# EAGLE design mayfly_platform_revC (EAGLE 8.5.0)
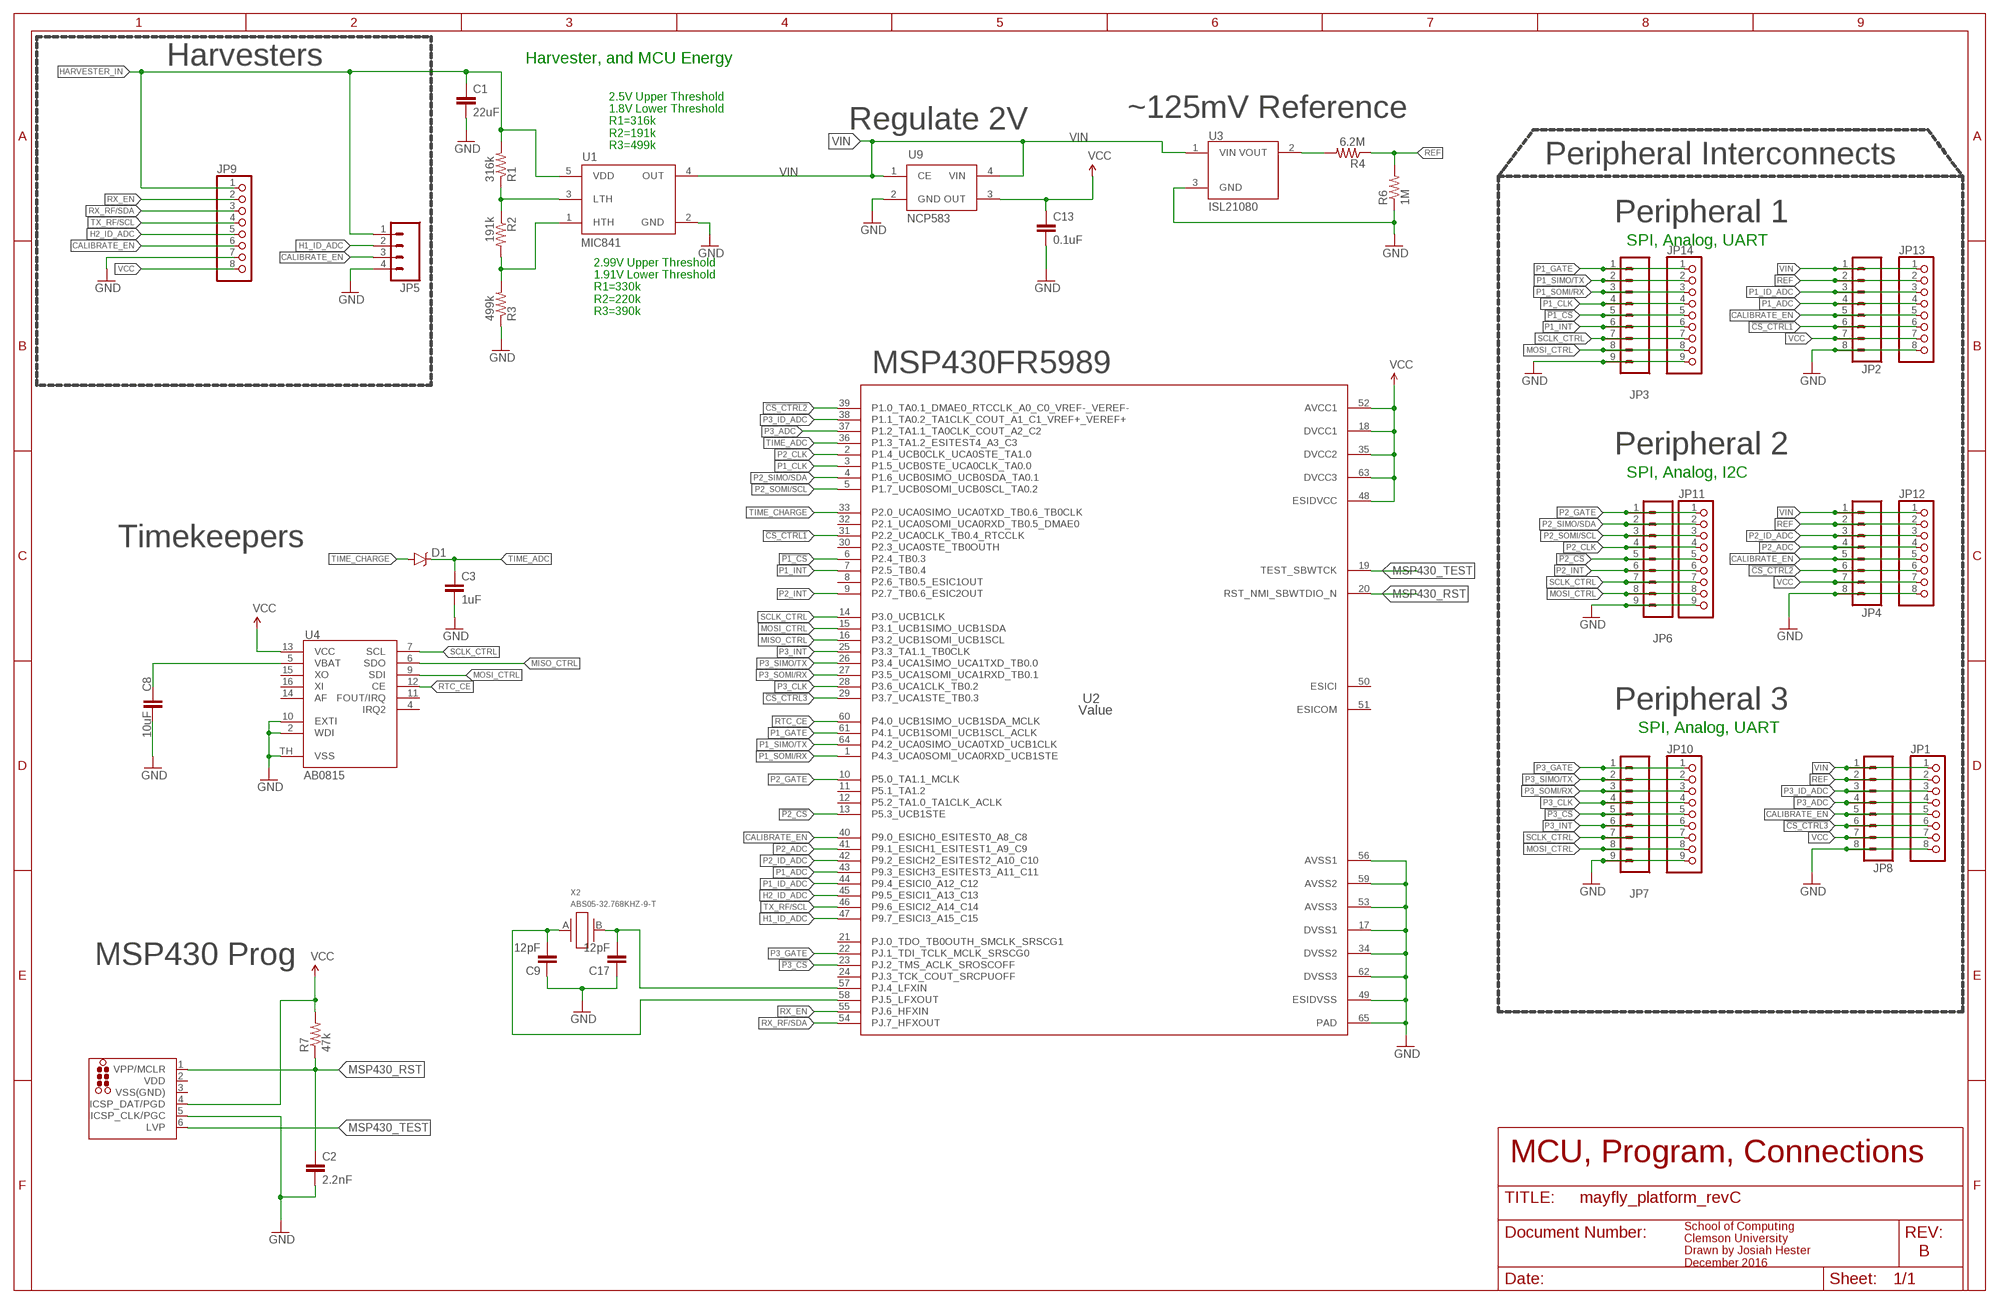
[diagram p0: schematic, sheet 1]

## Parts
C1  22uF  CAP1210  [1210]
C2  2.2nF  C-EU0603  [0603]
C3  1uF  C-EU0603  [0603]
C8  10uF  CAP0805  [0805]
C9  12pF  C-EU0603  [0603]
C13  0.1uF  C-EU0603  [0603]
C17  12pF  C-EU0603  [0603]
D1  RB751  DIODE-SCHOTTKY-RB751  [SOD-523]
J1  TC2030-MCP-NL  [TC2030-MCP-NL]
JP1  PINHD-1X8  [1X08]
JP2  M081.27MM  [1X08-1.27MM]
JP3  M091.27MM  [1X09-1.27MM]
JP4  M081.27MM  [1X08-1.27MM]
JP5  M041.27MM  [1X04-1.27MM]
JP6  M091.27MM  [1X09-1.27MM]
JP7  M091.27MM  [1X09-1.27MM]
JP8  M081.27MM  [1X08-1.27MM]
JP9  PINHD-1X8  [1X08]
JP10  PINHD-1X9  [1X09]
JP11  PINHD-1X9  [1X09]
JP12  PINHD-1X8  [1X08]
JP13  PINHD-1X8  [1X08]
JP14  PINHD-1X9  [1X09]
R1  316k  R-EU0603  [0603]
R2  191k  R-EU0603  [0603]
R3  499k  R-EU0603  [0603]
R4  6.2M  R-EU0603  [0603]
R6  1M  R-EU0603  [0603]
R7  47k  R-EU0603  [0603]
U1  MIC841  [SC70-5]
U2  Value  MSP430FR5989IRGCR  [RGC0064B]
U3  ISL21080  [SOT-23]
U4  AB0815  [QFN16]
U9  NCP583  [SC82-AB_1PRIMARY]
X2  ABS05-32.768KHZ-9-T  [ABS05]

## Nets
!CS_CTRL1: JP2.6 JP13.6 U2.31(P2.2_UCA0CLK_TB0.4_RTCCLK)
!CS_CTRL2: JP4.6 JP12.6 U2.39(P1.0_TA0.1_DMAE0_RTCCLK_A0_C0_VREF-_VEREF-)
!CS_CTRL3: JP1.6 JP8.6 U2.29(P3.7_UCA1STE_TB0.3)
!P1_CS: JP3.5 JP14.5 U2.6(P2.4_TB0.3)
!P2_CS: JP6.5 JP11.5 U2.13(P5.3_UCB1STE)
!P3_CS: JP7.5 JP10.5 U2.23(PJ.2_TMS_ACLK_SROSCOFF)
CALIBRATE_EN: JP1.5 JP2.5 JP4.5 JP5.3 JP8.5 JP9.6 JP12.5 JP13.5 U2.40(P9.0_ESICH0_ESITEST0_A8_C8)
GND: C1.2 C2.2 C3.2 C8.2 C9.1 C13.2 C17.1 J1.5(ICSP_CLK/PGC) JP1.8 JP2.8 JP3.9 JP4.8 JP5.4 JP6.9 JP7.9 JP8.8 JP9.7 JP10.9 JP11.9 JP12.8 JP13.8 JP14.9 R3.1 R6.1 U1.2(GND) U2.17(DVSS1) U2.34(DVSS2) U2.49(ESIDVSS) U2.53(AVSS3) U2.56(AVSS1) U2.59(AVSS2) U2.62(DVSS3) U2.65(PAD) U3.3(GND) U4.2(WDI) U4.10(EXTI) U4.TH(VSS) U9.2(GND)
H1_ID_ADC: JP5.2 U2.47(P9.7_ESICI3_A15_C15)
H2_ID_ADC: JP9.5 U2.45(P9.5_ESICI1_A13_C13)
HARVESTER_IN: C1.1 JP5.1 JP9.1 R1.2 U1.5(VDD)
MISO_CTRL: U2.16(P3.2_UCB1SOMI_UCB1SCL) U4.6(SDO)
MOSI_CTRL: JP3.8 JP6.8 JP7.8 JP10.8 JP11.8 JP14.8 U2.15(P3.1_UCB1SIMO_UCB1SDA) U4.9(SDI)
MSP430_RST: C2.1 J1.1(VPP/MCLR) R7.1 U2.20(RST_NMI_SBWTDIO_N)
MSP430_TEST: J1.6(LVP) U2.19(TEST_SBWTCK)
N$1: R1.1 R2.1 U1.3(LTH)
N$2: R4.2 U3.2(VOUT)
N$3: R2.2 R3.2 U1.1(HTH)
N$5: C17.2 U2.57(PJ.4_LFXIN) X2.B
N$6: C9.2 U2.58(PJ.5_LFXOUT) X2.A
N$8: C8.1 U4.5(VBAT)
P1_ADC: JP2.4 JP13.4 U2.43(P9.3_ESICH3_ESITEST3_A11_C11)
P1_CLK: JP3.4 JP14.4 U2.3(P1.5_UCB0STE_UCA0CLK_TA0.0)
P1_GATE: JP3.1 JP14.1 U2.61(P4.1_UCB1SOMI_UCB1SCL_ACLK)
P1_ID_ADC: JP2.3 JP13.3 U2.44(P9.4_ESICI0_A12_C12)
P1_INT: JP3.6 JP14.6 U2.7(P2.5_TB0.4)
P1_SIMO/TX: JP3.2 JP14.2 U2.64(P4.2_UCA0SIMO_UCA0TXD_UCB1CLK)
P1_SOMI/RX: JP3.3 JP14.3 U2.1(P4.3_UCA0SOMI_UCA0RXD_UCB1STE)
P2_ADC: JP4.4 JP12.4 U2.41(P9.1_ESICH1_ESITEST1_A9_C9)
P2_CLK: JP6.4 JP11.4 U2.2(P1.4_UCB0CLK_UCA0STE_TA1.0)
P2_GATE: JP6.1 JP11.1 U2.10(P5.0_TA1.1_MCLK)
P2_ID_ADC: JP4.3 JP12.3 U2.42(P9.2_ESICH2_ESITEST2_A10_C10)
P2_INT: JP6.6 JP11.6 U2.9(P2.7_TB0.6_ESIC2OUT)
P2_SIMO/SDA: JP6.2 JP11.2 U2.4(P1.6_UCB0SIMO_UCB0SDA_TA0.1)
P2_SOMI/SCL: JP6.3 JP11.3 U2.5(P1.7_UCB0SOMI_UCB0SCL_TA0.2)
P3_ADC: JP1.4 JP8.4 U2.37(P1.2_TA1.1_TA0CLK_COUT_A2_C2)
P3_CLK: JP7.4 JP10.4 U2.28(P3.6_UCA1CLK_TB0.2)
P3_GATE: JP7.1 JP10.1 U2.22(PJ.1_TDI_TCLK_MCLK_SRSCG0)
P3_ID_ADC: JP1.3 JP8.3 U2.38(P1.1_TA0.2_TA1CLK_COUT_A1_C1_VREF+_VEREF+)
P3_INT: JP7.6 JP10.6 U2.25(P3.3_TA1.1_TB0CLK)
P3_SIMO/TX: JP7.2 JP10.2 U2.26(P3.4_UCA1SIMO_UCA1TXD_TB0.0)
P3_SOMI/RX: JP7.3 JP10.3 U2.27(P3.5_UCA1SOMI_UCA1RXD_TB0.1)
REF: JP1.2 JP2.2 JP4.2 JP8.2 JP12.2 JP13.2 R4.1 R6.2
RTC_CE: U2.60(P4.0_UCB1SIMO_UCB1SDA_MCLK) U4.12(CE)
RX_EN: JP9.2 U2.55(PJ.6_HFXIN)
RX_RF/SDA: JP9.3 U2.54(PJ.7_HFXOUT)
SCLK_CTRL: JP3.7 JP6.7 JP7.7 JP10.7 JP11.7 JP14.7 U2.14(P3.0_UCB1CLK) U4.7(SCL)
TIME_ADC: C3.1 D1.C U2.36(P1.3_TA1.2_ESITEST4_A3_C3)
TIME_CHARGE: D1.A U2.33(P2.0_UCA0SIMO_UCA0TXD_TB0.6_TB0CLK)
TX_RF/SCL: JP9.4 U2.46(P9.6_ESICI2_A14_C14)
VCC: C13.1 J1.4(ICSP_DAT/PGD) JP1.7 JP2.7 JP4.7 JP8.7 JP9.8 JP12.7 JP13.7 R7.2 U2.18(DVCC1) U2.35(DVCC2) U2.48(ESIDVCC) U2.52(AVCC1) U2.63(DVCC3) U4.13(VCC) U9.3(OUT)
VIN: JP1.1 JP2.1 JP4.1 JP8.1 JP12.1 JP13.1 U1.4(OUT) U3.1(VIN) U9.1(CE) U9.4(VIN)
Unconnected: U2.8(P2.6_TB0.5_ESIC1OUT) U2.11(P5.1_TA1.2) U2.12(P5.2_TA1.0_TA1CLK_ACLK) U2.21(PJ.0_TDO_TB0OUTH_SMCLK_SRSCG1) U2.24(PJ.3_TCK_COUT_SRCPUOFF) U2.30(P2.3_UCA0STE_TB0OUTH) U2.32(P2.1_UCA0SOMI_UCA0RXD_TB0.5_DMAE0) U2.50(ESICI) U2.51(ESICOM) U4.4(IRQ2) U4.11(FOUT/IRQ) U4.14(AF) U4.15(XO) U4.16(XI)

## Notes on the sheet
- Harvesters | Harvester, and MCU Energy
- ~125mV Reference
- Regulate 2V
- 2.5V Upper Threshold
  1.8V Lower Threshold
  R1=316k
  R2=191k
  R3=499k
- Peripheral Interconnects
- Peripheral 1
- SPI, Analog, UART
- 2.99V Upper Threshold
  1.91V Lower Threshold
  R1=330k
  R2=220k
  R3=390k
- MSP430FR5989
- Peripheral 2
- SPI, Analog, I2C
- Timekeepers
- Peripheral 3
- SPI, Analog, UART
- MSP430 Prog
- MCU, Program, Connections
- B
- School of Computing
  Clemson University
  Drawn by Josiah Hester
  December 2016

## Power pins joined to a net without a drawn wire
VDD: J1.2(VDD)
VSS(GND): J1.3(VSS(GND))

## Library data of the parts
C1 = SparkFun-Capacitors:CAP: Capacitor Standard 0603 ceramic capacitor, and 0.1" leaded capacitor.; MANUFACTURERPARTNUMBER: CL32A226KAJNNNE; MPN: CL32A226KAJNNNE
C2 = tiny_passives:C-EU; MPN: 06035C222KAT2A
C3 = tiny_passives:C-EU; MANUFACTURERPARTNUMBER: 0603YD105KAT2A; MPN: 0603YD105KAT2A
C8 = SparkFun-Capacitors:CAP: Capacitor Standard 0603 ceramic capacitor, and 0.1" leaded capacitor.; MPN: 0805YD106KAT2A
C9 C17 = tiny_passives:C-EU; MPN: CL10C120JB8NNNC
C13 = tiny_passives:C-EU; MANUFACTURERPARTNUMBER: 0603YC104KAT2A; MPN: 0603YC104KAT2A
D1 = SparkFun-DiscreteSemi:DIODE-SCHOTTKY: Schottky diodes in SFE's production catalog BAT20J 1A 23V 0.62Vf RB751 120mA 40V 0.37Vf PMEG4005EJ 0.5A 40V 0.42Vf MBRA140 1A 40V 0.5Vf B340A 3A 40V SMA; DIGIKEY: BAS40-02V-V-G-08GICT-ND; MPN: BAS40-02V-V-G-08; PROD_ID: DIO-11018
J1 = tag-connect_msp430:TC2030: TAG-CONNECT ICSP Connector Manufacturer: Tag-Connect <http://www.tag-connect.com> Cable for easy In-Circuit Serial Programming. Designed for Microchip ICD2, suitable for many others. Two variants - one "with legs" (for hands-free fit on PCB) and another "without legs" for quick programming. PAD Description 1 MCLR/Vpp 2 Vdd 3 GND 4 PGD (ISPDAT) 5 PGC (ISPCLK) 6 nc (used for LVP) ©2009 ROFA.cz - modified and updated by Robert Darlington ‹rdarlington@gmail.com›
JP1 JP9 JP12 JP13 = pinhead:PINHD-1X8: PIN HEADER
JP2 JP4 JP8 = SparkFun-Connectors:M08: Header 8 Standard 8-pin 0.1" header. Use with straight break away headers (SKU : PRT-00116), right angle break away headers (PRT-00553), swiss pins (PRT-00743), machine pins (PRT-00117), and female headers (PRT-00115).; DIGIKEY: ED90570-ND; MPN: 851-43-008-10-001000
JP3 JP6 JP7 = SparkFun-Connectors:M09: Header 9 Standard 9-pin 0.1" header. Use with straight break away headers (SKU : PRT-00116), right angle break away headers (PRT-00553), swiss pins (PRT-00743), machine pins (PRT-00117), and female headers (PRT-00115).; DIGIKEY: 1212-1354-ND; MPN: 851-87-009-10-001101
JP5 = SparkFun-Connectors:M04: Header 4 Standard 4-pin 0.1" header. Use with straight break away headers (SKU : PRT-00116), right angle break away headers (PRT-00553), swiss pins (PRT-00743), machine pins (PRT-00117), and female headers (PRT-00115). Molex polarized connector foot print use with SKU : PRT-08231 with associated crimp pins and housings. 1MM SMD Version SKU: PRT-10208; DIGIKEY: ED90528-ND; MANUFACTURERPARTNUMBER: 851-43-004-10-001000; MPN: 851-43-004-10-001000
JP10 JP11 JP14 = pinhead:PINHD-1X9: PIN HEADER
R1 = tiny_passives:R-EU; DIGIKEY: 311-316KHRCT-ND; MANUFACTURERPARTNUMBER: RC0603FR-07316KL; MPN: RC0603FR-07316KL
R2 = tiny_passives:R-EU; DIGIKEY: 311-191KHRCT-ND; MANUFACTURERPARTNUMBER: RC0603FR-07191KL; MPN: RC0603FR-07191KL
R3 = tiny_passives:R-EU; DIGIKEY: 311-499KHRCT-ND; MANUFACTURERPARTNUMBER: RC0603FR-07499KL; MPN: RC0603FR-07499KL
R4 = tiny_passives:R-EU; DIGIKEY: 541-6.20MHCT-ND; MPN: CRCW06036M20FKEA
R6 = tiny_passives:R-EU; DIGIKEY: 311-1.00MHRCT-ND; MPN: RC0603FR-071ML
R7 = tiny_passives:R-EU; MPN: CRCW060347K0JNEA
U1 = fedpower:MIC841: MIC841:Comparator with reference and adj. hysteresis; DIGIKEY: 576-2923-1-ND; MPN: MIC841HYC5-TR
U2 = msp430fr5989:MSP430FR5989IRGCR; ALTERNATEPARTNUMBER: MSP430FR5989IRGCT; COMPTYPE: IC; DIGIKEY: 296-42031-1-ND; MANUFACTURER: Texas Instruments; MOUNTTYPE: SMT; MPN: MSP430FR59891IRGCT; PACKAGEREFERENCE: RGC0064B; PARTNUMBER: MSP430FR5989IRGCR; PIN_COUNT: 65; REFDES: RefDes; ROHS: Y; TYPE: TYPE
U3 = isl21080:ISL21080: Intersil: ISL21080, 300nA NanoPower Voltage References The ISL21080 analog voltage references feature low supply voltage operation at ultra-low 310nA typ, 1.5µA max operating current. Additionally, the ISL21080 family features guaranteed initial accuracy as low as ±0.2% and 50ppm/°C temperature coefficient. These references are ideal for general purpose portable applications to extend battery life at lower cost. The ISL21080 is provided in the industry standard 3 Ld SOT-23 pinout. The ISL21080 output voltages can be used as precision voltage sources for voltage monitors, control loops, standby voltages for low power states for DSP, FPGA, Datapath Controllers, microcontrollers and other core voltages: 0.9V, 1.024V, 1.25V, 1.5V, 2.048V, 2.5V, 3.0V, 3.3V, 4.096V and 5.0V. Special Note: Post-assembly x-ray inspection may lead to permanent changes in device output voltage and should be minimized or avoided. For further information, please see “Applications Information” on page 14 and AN1533, “X-Ray Effects on Intersil FGA References”.; DIGIKEY: ISL21080DIH309Z-TKCT-ND; MPN: ISL21080DIH309Z-TK
U4 = AB08XX:AB0815: AB08X5 Real-Time Clock Family: SPI The ABRACON AB08X5 Real-Time Clock family provides a groundbreaking combination of ultra-low power coupled with a highly sophisticated feature set. With power requirements significantly lower than any other industry RTC (as low as 14 nA), these are the first semiconductors based on innovative SPOTTM (Subthreshold Power Optimized Technology) CMOS platform. The AB08X5 includes on-chip oscillators to provide minimum power consumption, full RTC functions including battery backup and programmable counters and alarms for timer and watchdog functions, and either an I2C or SPI serial interface for communication with a host controller.; DIGIKEY: 535-11930-1-ND; MPN: AB0815-T3
U9 = ncp583:NCP583: NCP583 - Ultra-Low Iq 150 mA CMOS LDO Regulator with Enable The NCP583 series of low dropout regulators are designed for portable battery powered applications which require precise output voltage accuracy and low quiescent current. These devices feature an enable function which lowers current consumption significantly and are offered in two small packages; SC−82AB and the SOT−563. A 1.0 mF ceramic capacitor is the recommended value to be used with these devices on the output pin.; DIGIKEY: NCP583SQ18T1GOSCT-ND; MPN: NCP583SQ18T1G
X2 = abs05:ABS05-32.768KHZ: 32.768kHz Crystal; DIGIKEY: 535-11897-1-ND; MPN: ABS05-32.768KHZ-9-T

## Board
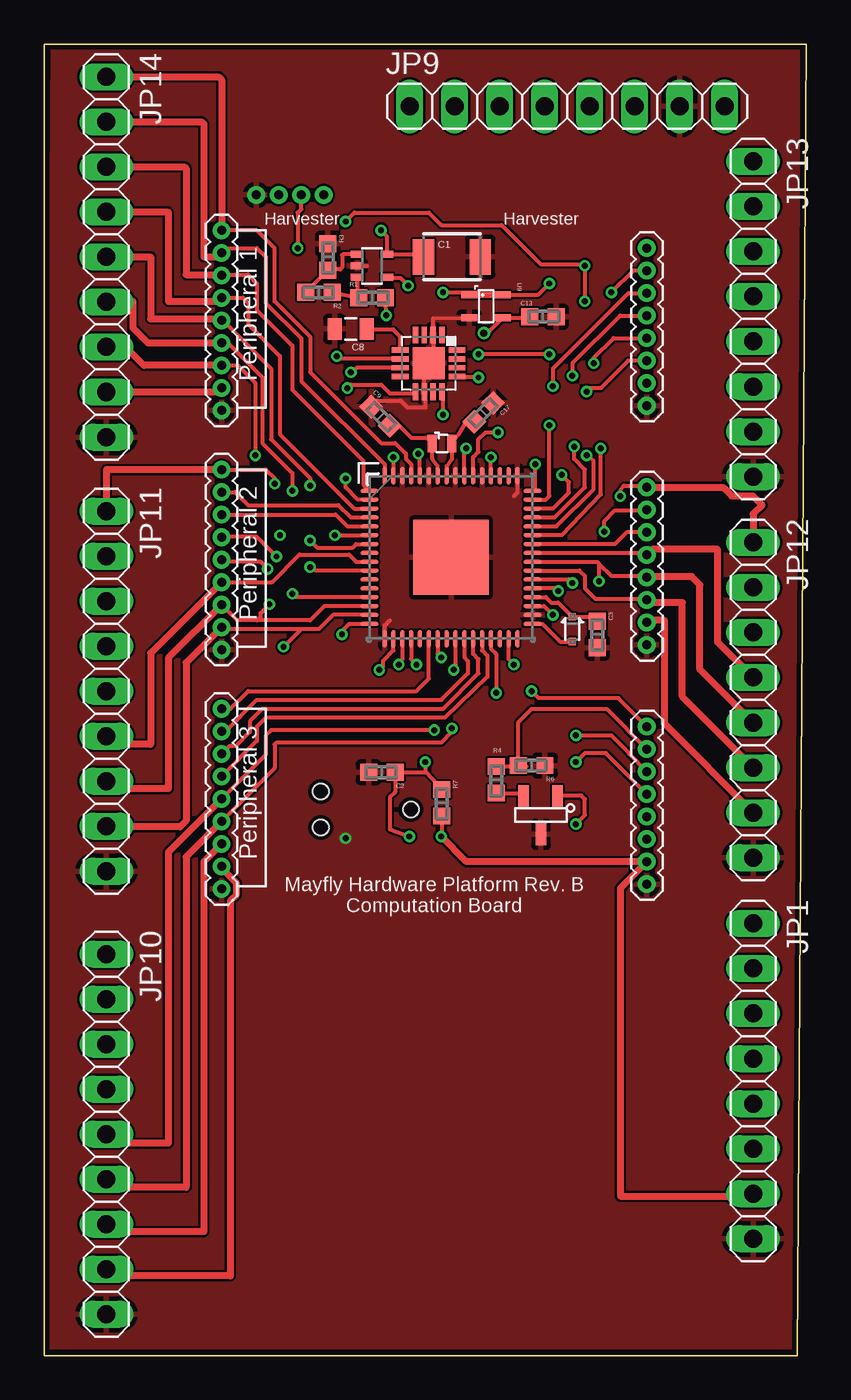
[diagram p1: board, top side]
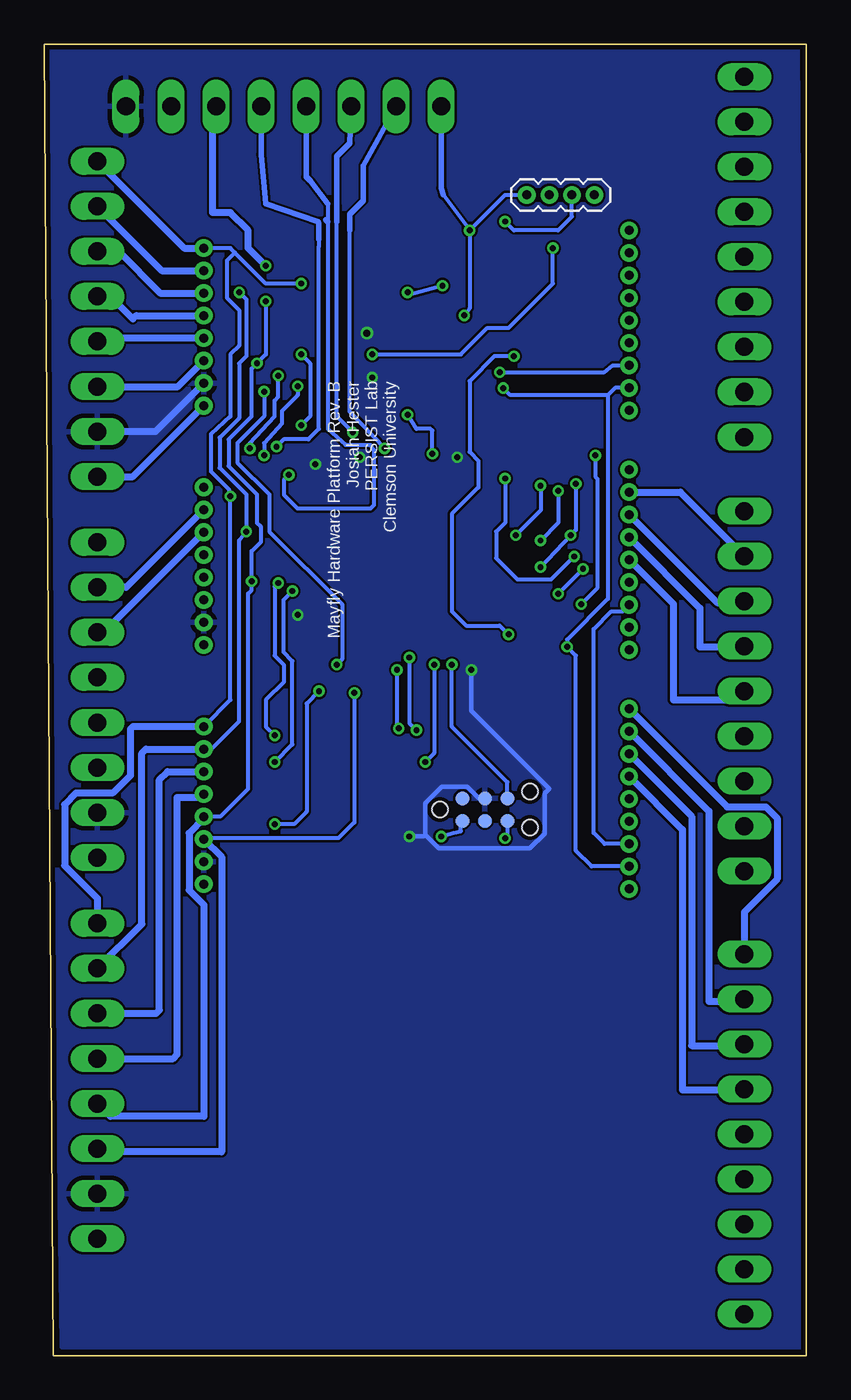
[diagram p2: board, bottom side, seen from below]

Size 43 x 74 mm. Coordinates in mm from the lower left corner, seen from the top.
Outline: 43,74 0,74 0,0 42.5,0 43,74
Copper layers (1*16): Top 0.035mm / dielectric 1.5mm / Bottom 0.035mm
Design rules "MF_Standard_2_Layer": minimum track width 5mil, minimum drill 12mil, track to track 5mil, track to pad 5mil, pad to pad 5mil, via to via 5mil, smd to smd 0mil, copper to edge 10mil, drill to drill 10mil, minimum pad ring 6mil, minimum via ring 6mil, stop-mask expansion 2mil, vias tented up to drill 25mil, thermal gap 10mil

### Footprints (pad centres in the part's own frame; a part is rotated, then mirrored left to right if it is on the bottom)
1210 = smd 1.2 x 2: 1 -1.6,0; 2 1.6,0
0603 = smd 0.95 x 0.95: 1 -0.75,0; 2 0.75,0
0805 = smd 0.8 x 1.2: 1 -0.9,0; 2 0.9,0
SOD-523 = smd 0.4 x 0.4: A -0.7,0; C 0.7,0
TC2030-MCP-NL = smd 0.787 x 0.787: 1 1.27,-0.635; 2 1.27,0.635; 3 2.54,-0.635; 4 2.54,0.635; 5 3.81,-0.635; 6 3.81,0.635 | hole 0.889: 0,0; 5.08,-1.016; 5.08,1.016
1X08 = drill 1.016 long: 1 -8.89,0; 2 -6.35,0; 3 -3.81,0; 4 -1.27,0; 5 1.27,0; 6 3.81,0; 7 6.35,0; 8 8.89,0
1X08-1.27MM = drill 0.508 pad 1: 1 0,0; 2 1.27,0; 3 2.54,0; 4 3.81,0; 5 5.08,0; 6 6.35,0; 7 7.62,0; 8 8.89,0
1X09-1.27MM = drill 0.508 pad 1: 1 0,0; 2 1.27,0; 3 2.54,0; 4 3.81,0; 5 5.08,0; 6 6.35,0; 7 7.62,0; 8 8.89,0; 9 10.16,0
1X04-1.27MM = drill 0.508 pad 1: 1 0,0; 2 1.27,0; 3 2.54,0; 4 3.81,0
1X09 = drill 1.016 long: 1 -10.16,0; 2 -7.62,0; 3 -5.08,0; 4 -2.54,0; 5 0,0; 6 2.54,0; 7 5.08,0; 8 7.62,0; 9 10.16,0
SC70-5 = smd 0.4 x 0.7: 1 -0.65,-0.85; 2 0,-0.85; 3 0.65,-0.85; 4 0.65,0.85; 5 -0.65,0.85
RGC0064B = smd 1 x 0.23: 1 -4.6,3.75; 2 -4.6,3.25; 3 -4.6,2.75; 4 -4.6,2.25; 5 -4.6,1.75; 6 -4.6,1.25; 7 -4.6,0.75; 8 -4.6,0.25; 9 -4.6,-0.25; 10 -4.6,-0.75; 11 -4.6,-1.25; 12 -4.6,-1.75; 13 -4.6,-2.25; 14 -4.6,-2.75; 15 -4.6,-3.25; 16 -4.6,-3.75; 33 4.6,-3.75; 34 4.6,-3.25; 35 4.6,-2.75; 36 4.6,-2.25; 37 4.6,-1.75; 38 4.6,-1.25; 39 4.6,-0.75; 40 4.6,-0.25; 41 4.6,0.25; 42 4.6,0.75; 43 4.6,1.25; 44 4.6,1.75; 45 4.6,2.25; 46 4.6,2.75; 47 4.6,3.25; 48 4.6,3.75 | smd 0.23 x 1: 17 -3.751,-4.6; 18 -3.251,-4.6; 19 -2.751,-4.6; 20 -2.251,-4.6; 21 -1.75,-4.6; 22 -1.25,-4.6; 23 -0.75,-4.6; 24 -0.25,-4.6; 25 0.25,-4.6; 26 0.75,-4.6; 27 1.25,-4.6; 28 1.75,-4.6; 29 2.251,-4.6; 30 2.751,-4.6; 31 3.251,-4.6; 32 3.751,-4.6; 49 3.751,4.6; 50 3.251,4.6; 51 2.751,4.6; 52 2.251,4.6; 53 1.75,4.6; 54 1.25,4.6; 55 0.75,4.6; 56 0.25,4.6; 57 -0.25,4.6; 58 -0.75,4.6; 59 -1.25,4.6; 60 -1.75,4.6; 61 -2.251,4.6; 62 -2.751,4.6; 63 -3.251,4.6; 64 -3.751,4.6 | smd 4.242 x 4.242: 65 0,0
SOT-23 = smd 0.6 x 1.25: 1 -0.95,-1.075; 2 0.95,-1.075; 3 -0.025,1.075
QFN16 = smd 0.95 x 0.3: 1 -1.6,0.75; 2 -1.6,0.25; 3 -1.6,-0.25; 4 -1.6,-0.75; 9 1.6,-0.75; 10 1.6,-0.25; 11 1.6,0.25; 12 1.6,0.75 | smd 0.3 x 0.95: 5 -0.75,-1.6; 6 -0.25,-1.6; 7 0.25,-1.6; 8 0.75,-1.6; 13 0.75,1.6; 14 0.25,1.6; 15 -0.25,1.6; 16 -0.75,1.6 | smd 1.8 x 1.8: TH 0,0
SC82-AB_1PRIMARY = smd 0.406 x 0.914: 1 -0.621,-0.913; 2 0.675,-0.913; 3 0.675,0.967; 4 -0.621,0.967
ABS05 = smd 0.5 x 1: A -0.55,0; B 0.55,0

### Placement (x,y rotation side)
C1  23,62 0 top
C2  19.05,32.92 180 top
C3  31.2,40.7 270 top
C8  17.29,57.94 180 top
C9  18.97,53.01 315 top
C13  28.14,58.63 0 top
C17  24.79,53.23 225 top
D1  29.8,41 90 top
J1  20.68,30.82 0 bottom
JP1  40,15.5 270 top
JP2  34,62.5 270 top
JP3  10,63.5 270 top
JP4  34,49 270 top
JP5  15.77,65.5 0 bottom
JP6  10,50 270 top
JP7  10,36.5 270 top
JP8  34,35.5 270 top
JP9  29.5,70.5 0 top
JP10  3.5,12.5 270 top
JP11  3.5,37.5 270 top
JP12  40,37 270 top
JP13  40,58.5 270 top
JP14  3.5,62 270 top
R1  18.5,59.7 0 top
R2  15.5,60 180 top
R3  16,62 270 top
R4  25.5,32.5 270 top
R6  27.5,33.3 180 top
R7  22.43,31.2 270 top
U1  18.5,61.5 270 top
U2  22.95,45.05 0 top
U3  28,30.5 180 top
U4  21.69,56 270 top
U9  24.89,59.25 270 top
X2  22.45,51.47 0 top

### Tracks (layer width: path | path; a pad name or v marks a point on that pad's centre or on a via)
!CS_CTRL1  (via drill 0.33)
  Top 0.222: JP2.6 32.95,56.15 31.4,54.6 30.8,54.6 v30.6,54.4 | v26.5,39 26.2,39.3 U2.31
  Top 0.406: 34.04,56.19 JP2.6
  Bottom 0.222: v30.6,54.4 30.6,53 32.1,51.5 32.1,50.4 30.3,48.6 30.3,46.5 26.2,42.4 26.2,39.3 v26.5,39
  Bottom 0.406: JP13.6 35.46,54.69 JP2.6
!CS_CTRL2
  Top 0.222: U2.39 30.2,44.3 30.5,44 30.5,43.3 31.1,42.7 33.95,42.7 JP4.6
  Top 0.406: 33.95,42.7 34.15,42.5 36,42.5 36,37.19 JP12.6
!CS_CTRL3  (via drill 0.33)
  Top 0.222: U2.29 25.2,39.9 25.5,39.6 v25.5,37.4
  Bottom 0.222: v25.5,37.4 25.5,30.1 26.4,29.2 33.95,29.2 JP8.6
  Bottom 0.406: JP8.6 33,28.15 33,11.5 39.81,11.5 JP1.6
!P1_CS  (via drill 0.33)
  Top 0.222: v15,49.1 15,49.5 12.8,51.7 12.8,55.7 10.08,58.42 JP3.5 | v16.4,46.3 U2.6 | U2.6
  Top 0.406: JP14.5 6,62 6,58.5 10,58.5 10.08,58.42
  Bottom 0.222: v15,49.1 15,47.7 v16.4,46.3
!P2_CS  (via drill 0.33)
  Top 0.222: U2.13 14.2,42.8 v14,43 | v12.6,44.4 12.2,44.8 10.12,44.8 JP6.5
  Bottom 0.222: v14,43 v12.6,44.4
  Bottom 0.406: JP6.5 7.5,42.42 7.5,37 4,37 JP11.5
!P3_CS  (via drill 0.33)
  Top 0.222: U2.23 22.2,39.6 v22.4,39.4 | v22,35.3 12.8,35.3 12.5,35 12.5,33.92 JP7.5
  Top 0.406: JP7.5 7,28.42 7,12 4,12 JP10.5
  Bottom 0.222: v22.4,39.4 22.4,35.7 v22,35.3
CALIBRATE_EN  (via drill 0.33)
  Top 0.222: JP4.5 33.96,43.96 33.92,44 32,44 31.3,44.7 | v31,56 31,56.3 32.12,57.42 JP2.5 | U2.40 31.2,44.8 31.3,44.7 | 31.3,44.7 v31.3,43.7 | v30.5,59.5 v30.5,61.5 30.4,61.6 28,61.6 25.8,63.8 22.4,63.8 21.7,64.5 17.5,64.5 v17,64
  Top 0.406: JP12.5 37,38.73 37,43.5 36.54,43.96 33.96,43.96
  Bottom 0.222: JP8.5 33.08,30.42 31.5,32 31.5,43 31.3,43.2 v31.3,43.7 31.3,45.4 30.8,45.9 30.8,46.8 31,47 31,48.6 32.6,50.2 32.6,51.7 31.3,53 31.3,55.7 v31,56 30.5,56.5 v30.5,59.5 | 30.85,61.85 v30.5,61.5 | v17,64 16.5,63.5 14,63.5 13.23,64.27 JP5.3
  Bottom 0.406: v30.5,61.5 31.5,62.5 31.5,63.5 32.5,64.5 33.5,64.5 33.5,70.31 JP9.6 | JP8.5 34,30.32 34.83,29.49 34.83,26.27 34,25.44 34,13.5 39.27,13.5 JP1.5 | JP2.5 39.81,57.42 JP13.5
GND  (via drill 0.33)
  Top 0.222: U9.2 21.94,58.54 U4.2 21.94,56.25 U4.TH 21.44,55.75 U4.10 21.5,54.34 21.5,53.5 20.5,53.5 20.1,53.9 18.8,53.9 C9.1 | U1.2 18.2,61.5 | v17,29.2 17,29 | U2.17 19.2,41.2 19.5,41.5 | U2.49 26.7,48.7 26.5,48.5
  Bottom 0.222: J1.5 16.87,29.33 v17,29.2
  Bottom 0.406: JP13.8 38,49.61 JP2.8
  pour Top: 0,0.5 42.5,0.5 42.5,74 0.5,74
H1_ID_ADC  (via drill 0.33)
  Top 0.222: U2.47 28.3,48.3 28.5,48.5 v28.5,52.5 | v28.5,56.5 v24.5,56.5 | v14.3,62.5 14.3,64.5 14.5,64.7 JP5.2
  Bottom 0.222: v24.5,56.5 19.5,56.5 18,58 16.8,58 14.3,60.5 v14.3,62.5 | v28.5,56.5 28,56 28,53 v28.5,52.5
H2_ID_ADC  (via drill 0.33)
  Top 0.222: U2.45 28.8,47.3 30.5,49 30.5,50 29.9,50.6 v29.9,51.3
  Bottom 0.22: 27.5,63.19 27.5,63 27.5,62.6
  Bottom 0.222: 27.5,62.6 27.5,52.3 28.1,51.7 29.5,51.7 v29.9,51.3
  Bottom 0.305: JP9.5 30.77,67.77 30.5,65 27.54,64 27.54,63.93 27.5,63.89 27.5,63
HARVESTER_IN  (via drill 0.33)
  Top 0.222: v19.3,58.7 19.3,58.95 R1.2 | C1.1 21.25,62.15 U1.5 19.35,63.15 v19,63.5
  Bottom 0.222: v19,63.5 19,59.1 v19.3,58.7 | v19,63.5 17,65.5 JP5.1 | 20.5,65.5 v19,63.5
  Bottom 0.305: JP9.1 20.61,65.89 20.5,65.5
MISO_CTRL  (via drill 0.33)
  Top 0.222: U4.6 16.65,56.25 v16.5,56.4 | v16.8,40.7 16.8,40.9 17.2,41.3 U2.16 | U2.16
  Bottom 0.222: v16.5,56.4 17.6,56.4 19,55 19,51 18.5,50.5 18.5,49 20,47.5 20,42 19.2,41.2 17.3,41.2 v16.8,40.7
MOSI_CTRL  (via drill 0.33)
  Top 0.222: U2.15 16.3,41.8 15.5,41 14.5,41 | 14.5,41 10.11,41 JP6.8 | v13.5,40 14.5,41 | v17.1,54.6 17.3,54.8 19,54.8 19.5,54.3 20.84,54.3 U4.9
  Top 0.406: JP14.8 9.77,54.38 JP3.8 | JP7.8 10,27.51 10.83,26.68 10.83,26 10.5,25.67 10.5,4.5 3.88,4.5 JP10.8 | JP6.8 8,39.11 8,30.17 7.66,29.84 3.54,29.84 JP11.8
  Bottom 0.222: JP7.8 12.11,27.61 13,28.5 13,39.5 v13.5,40 | JP3.8 10.79,54.61 11.2,54.2 | 11.2,54.2 11.2,42.7 13.5,40.4 v13.5,40 | 13.6,40.1 v13.5,40 | 11.2,54.2 16.7,54.2 v17.1,54.6
MSP430_RST  (via drill 0.33)
  Top 0.222: 21.54,32.92 C2.1 19.8,31.8 19.5,31.5 19.5,29.7 v20.6,29.3 | 21.54,32.92 R7.1 | U2.20 20.7,39.3 v21,39 | v21.5,33.5 21.5,32.96 21.54,32.92
  Bottom 0.222: v20.6,29.3 19.9,29.5 19.5,29.6 19.5,30.09 J1.1 | v21,39 21,34 v21.5,33.5
MSP430_TEST  (via drill 0.33)
  Top 0.222: U2.19 20.2,39.3 v20,39
  Bottom 0.222: J1.6 16.87,32.37 20,35.5 v20,39
N$1
  Top 0.222: R2.1 R1.1 17.65,59.8 U1.3
N$2
  Top 0.222: R4.2 26.88,31.75 U3.2
N$3
  Top 0.222: R2.2 R3.2 16.05,61.3 16.7,61.3 16.8,61.4 16.8,62.1 16.85,62.15 U1.1
N$5
  Top 0.222: U2.57 22.7,50.2 23,50.6 X2.B 23.4,52 23.8,52.7 24.16,52.9 C17.2 | U2.57
N$6
  Top 0.222: U2.58 22.2,50.2 21.9,50.6 X2.A 21.57,51.8 20.7,51.8 19.72,52.78 C9.2
N$8
  Top 0.222: U4.5 20.09,57.51 19.7,57.9 18.23,57.9 C8.1
P1_ADC  (via drill 0.33)
  Top 0.222: U2.43 29.2,46.3 31.4,48.6 v31.4,51.2 | U2.43 | v29.8,55.3 29.8,56 32.49,58.69 JP2.4
  Bottom 0.222: v31.4,51.2 31.4,51.5 30,53 30,53.9 29.8,54.1 v29.8,55.3
  Bottom 0.406: JP13.4 39.27,59.77 38,58.5 37.81,58.69 JP2.4
P1_CLK
  Top 0.222: U2.3 17.5,47.8 13.3,52 13.3,56.4 11.5,58.2 11.5,59.4 11.2,59.7 JP3.4 | U2.3
  Top 0.406: JP14.4 6.96,64.54 7,64.5 7,59.5 9.81,59.5 JP3.4
P1_GATE
  Top 0.222: JP3.1 12,63.5 13,62.5 13,59.5 15,57.5 15,55.5 19,51.5 19.8,51.5 20.4,50.9 20.4,50.6 20.7,50.3 U2.61
  Top 0.406: JP14.1 9.84,72.16 10,72 JP3.1
P1_ID_ADC  (via drill 0.33)
  Top 0.222: U2.44 28.9,46.8 31,48.9 31,50.5 v30.6,50.8 | v28.7,54.7 28.7,55.7 32.96,59.96 JP2.3
  Bottom 0.222: v28.7,54.7 28.7,54.2 29.6,53.3 29.6,52.6 30.6,51.5 v30.6,50.8
  Bottom 0.406: JP13.3 38.81,62.31 36.46,59.96 JP2.3
P1_INT  (via drill 0.33)
  Top 0.222: v14,48.8 14,49.8 12.3,51.5 12.3,55.2 10.35,57.15 JP3.6 | v15,46 15.4,45.6 17.4,45.6 17.6,45.8 U2.7 | U2.7
  Top 0.406: JP14.6 4.96,59.46 5,59.5 5,58 5.85,57.15 JP3.6
  Bottom 0.222: v14,48.8 14,47 v15,46
P1_SIMO/TX
  Top 0.222: U2.64 19.2,50.3 14.5,55 14.5,57.4 12.5,59.4 12.5,62 12,62.5 10.27,62.5 JP3.2
  Top 0.406: JP14.2 8.88,69.62 9,69.5 9,62 9.77,62 JP3.2
P1_SOMI/RX
  Top 0.222: U2.1 18,49.15 18,50.5 14,54.5 14,57 12,59 12,60.5 11.5,61 10.04,61 JP3.3
  Top 0.406: JP14.3 7.92,67.08 8,67 8,61 10.04,61
P2_ADC
  Top 0.222: U2.41 33.89,45.3 JP4.4
  Top 0.406: JP12.4 38,40.27 38,45.5 34.31,45.5 JP4.4
P2_CLK  (via drill 0.33)
  Top 0.222: U2.2 17.7,48.3 17,49 v17,49.5 | v13.1,45.1 12,46.2 JP6.4
  Bottom 0.222: v17,49.5 17,47 17.5,46.5 17.5,45 16.3,43.8 14.4,43.8 v13.1,45.1
  Bottom 0.406: JP6.4 6,42.19 6,40 3.54,40 JP11.4
P2_GATE  (via drill 0.33)
  Top 0.222: JP6.1 12.5,50 13,49.5 v13,49.2 | U2.10 | U2.10 15.3,44.3 v15,44.5
  Top 0.406: JP6.1 3.5,50 JP11.1
  Bottom 0.222: v13,49.2 13,46.6 v13.3,46.3 v15,44.5
P2_ID_ADC
  Top 0.222: JP4.3 32.86,46.46 32.2,45.8 U2.42 | U2.42
  Bottom 0.406: JP4.3 39.65,40.81 JP12.3
P2_INT
  Top 0.222: JP6.6 12.85,43.65 14.4,45.2 17.2,45.2 17.6,44.8 U2.9 | U2.9
  Top 0.406: JP6.6 6,39.65 6,34.5 3.96,34.5 JP11.6
P2_SIMO/SDA
  Top 0.222: U2.4 17.3,47.3 16.6,48 11.5,48 10.77,48.73 JP6.2 | U2.4
  Bottom 0.406: JP6.2 7.11,48.73 JP11.2
P2_SOMI/SCL
  Top 0.222: JP6.3 16.44,47.46 17.1,46.8 U2.5 | U2.5
  Bottom 0.406: JP6.3 5.04,42.5 3.58,42.5 JP11.3
P3_ADC  (via drill 0.33)
  Top 0.222: v30,33.5 30.5,34 31.69,34 JP8.4 | U2.37 28.85,43.3 v29,43.15 | U2.37
  Bottom 0.222: v30,33.5 29,34.5 29,39.2 29.5,39.7 29.5,42.65 v29,43.15
  Bottom 0.406: JP1.4 35.73,16.77 35.5,17 35.5,31.5 34.19,31.5 JP8.4
P3_CLK
  Top 0.222: U2.28 24.7,39.8 25,39.5 25,38.3 22.6,36 12.5,36 12,35.5 12,34.69 JP7.4
  Bottom 0.406: JP7.4 7,29.69 7,15 3.54,15 JP10.4
P3_GATE
  Top 0.222: U2.22 21.7,38.2 21,37.5 11.5,37.5 10.5,36.5 JP7.1 | U2.22
  Bottom 0.406: JP7.1 4.47,30.97 2.29,30.97 1.65,30.33 1.65,26.89 3.5,25.03 JP10.1
P3_ID_ADC  (via drill 0.33)
  Top 0.222: U2.38 29.6,43.8 v29.8,43.6 | v30,35 32,35 33,34 33,33.96 JP8.3
  Bottom 0.222: v30,35 30.5,35.5 30.5,37 29.5,38 29.5,39 30,39.5 30,43.4 v29.8,43.6
  Bottom 0.406: JP1.3 36.69,19.31 36.5,19.5 36.5,32.5 36.04,32.96 JP8.3
P3_INT  (via drill 0.33)
  Top 0.222: U2.25 23.2,38.9 v23.1,38.7 | v23,35.4 23,35.2 22.4,34.6 13.1,34.6 13,34.5 13,33.15 JP7.6
  Top 0.406: JP7.6 8,28.15 8,9.5 3.96,9.5 JP10.6
  Bottom 0.222: v23.1,38.7 23.1,35.6 v23,35.4
P3_SIMO/TX
  Top 0.222: U2.26 | U2.26 23.7,39.4 23.9,39.2 23.9,38.5 22.4,37 12,37 10.23,35.23 JP7.2
  Bottom 0.406: JP7.2 5.5,30.73 5.5,20 3.62,20 JP10.2
P3_SOMI/RX
  Top 0.222: U2.27 24.2,39.6 24.5,39.3 24.5,38.5 22.5,36.5 12.3,36.5 11.6,35.8 11.6,35.2 10.8,34.4 10.44,34.4 JP7.3 | U2.27
  Bottom 0.406: JP7.3 6.47,30.43 6.47,17.5 3.58,17.5 JP10.3
REF  (via drill 0.33)
  Top 0.222: v31.6,46.5 31.6,47.1 32.2,47.7 33.97,47.7 JP4.2 | R4.1 27.2,33.25 R6.2 26.75,35.75 27.5,36.5 31.73,36.5 JP8.2 | JP2.2 33.23,61.23 v32,60
  Bottom 0.222: v32,60 31.6,59.6 31.6,56.4 32,56 32,52.9 33.1,51.8 33.1,50.1 31.6,48.6 v31.6,46.5 32,46 32,35.8 33.57,34.23 JP8.2
  Bottom 0.406: JP1.2 37.5,24.35 37.5,34 37.27,34.23 JP8.2 | JP4.2 38.38,43.35 JP12.2 | JP13.2 36.38,61.23 JP2.2
RTC_CE  (via drill 0.33)
  Top 0.222: U2.60 21.2,50.8 v21.1,50.9 | v22.5,53.1 22.5,54.34 U4.12
  Bottom 0.222: v21.1,50.9 21.1,52.2 21.2,52.3 22,52.3 v22.5,53.1
RX_EN  (via drill 0.33)
  Top 0.222: U2.55 | U2.55 23.7,51.1 v23.8,51.2
  Bottom 0.22: 25.77,53.27 25.77,63.5 25.77,64.23
  Bottom 0.222: 25.77,53.27 v23.8,51.2
  Bottom 0.305: 25.77,63.5 25.77,64.4 24.99,65.18 24.99,67.16 JP9.2
RX_RF/SDA  (via drill 0.33)
  Top 0.222: U2.54 24.2,50.7 24.5,51 24.5,51.7 24.9,52.1 v25.6,52.1
  Bottom 0.222: v25.6,52.1 26.5,53 26.5,64 | 26.5,64.94 26.5,64.96
  Bottom 0.305: 26.5,64 26.5,64.94 26.5,67.69 25.76,68.43 JP9.3
SCLK_CTRL  (via drill 0.33)
  Top 0.222: U2.14 15.8,42.3 15,41.5 12,41.5 | 12,41.5 10.88,41.5 JP6.7 | 12,41.5 12.2,41.7 12.2,41.9 v12.7,42.4 | JP3.7 10.92,55.88 11.9,54.9 v11.9,50.8 | U4.7 17.65,55.75 v17.3,55.5
  Top 0.406: JP3.7 5.62,55.88 4.58,56.92 JP14.7 | JP7.7 9,27.88 9,7 3.92,7 JP10.7 | JP6.7 7,39.38 7,32 3.92,32 JP11.7
  Bottom 0.222: JP7.7 11.38,28.88 12,29.5 12,41 11,42 10.38,42 JP6.7 | v11.9,50.8 11.9,49.6 11.8,49.5 11.8,43.3 v12.7,42.4 | v17.3,55.5 11.4,55.5 10.92,55.88 JP3.7
TIME_ADC
  Top 0.222: U2.36 28.3,42.8 28.6,42.5 29,42.5 D1.C 30.95,41.7 C3.1
TIME_CHARGE
  Top 0.222: U2.33 28.1,41.3 29.1,40.3 D1.A
TX_RF/SCL  (via drill 0.33)
  Top 0.222: U2.46 28.7,47.8 29.6,48.7 29.6,49.3 v29.2,49.7 | U2.46
  Bottom 0.222: 27,65 27,64 27,52.3 26,51.4 24.6,51.4 24.4,51.1 24.4,48 24.6,47.8 28.7,47.8 29.45,48.55 29.45,49.45 v29.2,49.7
  Bottom 0.305: JP9.4 28.23,66.52 28,66.29 27,65 | 27.11,64.11 27,64
VCC  (via drill 0.33, 0.4)
  Top 0.222: U2.18 19.7,39.8 19.1,39.2 19.1,38.9 v18.9,38.7 | U2.48 27.7,48.8 v27.7,50.3 | v25.2,50.7 25.2,50.8 U2.52 | v19.7,50.7 U2.63 | v24.8,57.7 24.98,57.7 U9.3 27.34,58.58 C13.1 | v24.5,55.2 23.34,55.2 U4.13 | R7.2 22.43,29.57 v22.4,29.3 | U2.35 28.2,42.3 v28.7,41.8
  Top 0.406: JP8.7 23.82,27.88 v22.4,29.3 | 34.12,28 JP8.7 | JP8.7 32.5,26.38 32.5,9 39.85,9 JP1.7 | JP12.7 35,35.65 35,41.5 34.12,41.5 JP4.7
  Bottom 0.254: v18.9,38.7 18.9,36.4 14.5,32 14.77,31.73 14.77,29.46 15.61,28.63 20.74,28.63 21.51,29.39 | 21.51,29.39 21.51,31.16 20.56,32.1 19.14,32.1 18.49,31.45 J1.4 | 21.51,29.39 21.6,29.3 v22.4,29.3
  Bottom 0.406: JP2.7 36.73,52.15 JP13.7
  pour Bottom: 0,0.5 42,0.5 43,74 0.5,74
VIN  (via drill 0.33)
  Top 0.222: v32.5,48.5 32.5,48.8 32.7,49.1 33.9,49.1 JP4.1 | v20.53,60.37 20.1,60.8 19.4,60.8 U1.4 | 23.87,59.87 24.5,59.87 24.37,60 v22.5,60 | 28.3,60.3 v28.5,60.5 27.87,59.87 U9.4 | JP8.1 32.4,37.1 27.9,37.1 v27.5,37.5 | v30,30 30.5,30.5 30.5,31.4 30.3,31.6 28.98,31.6 U3.1
  Top 0.333: U9.1 24.5,59.87 U9.4
  Top 0.406: JP4.1 38.3,49 38.79,48.52 39.98,48.52 40.5,48 40,47.5 JP12.1
  Bottom 0.222: v28.5,60.5 30.5,60.5 32.25,62.25 | v20.53,60.37 22.37,59.87 v22.5,60 | JP8.1 32.5,37 v32.5,48.5 32.6,48.9 33.6,49.9 33.6,52 32.5,53 32.5,56.5 32,57 32,59 32.7,59.7 32.7,61.8 32.25,62.25 | 32.25,62.25 32.5,62.5 JP2.1 | v27.5,37.5 28.2,36.8 28.2,30.7 28.9,30 v30,30
  Bottom 0.406: JP8.1 38,35.5 38.15,35.35 38.15,32.74 39.14,31.74 41.21,31.74 41.85,31.1 41.85,27.66 40,25.8 JP1.1 | JP13.1 35.11,62.5 JP2.1

### Text on the board
tPlace: Harvester | Harvester | Peripheral 1 | Peripheral 2 | Peripheral 3 | Mayfly Hardware Platform Rev. B / Computation Board
bPlace: Mayfly Hardware Platform Rev. B / Josiah Hester / PERSIST Lab / Clemson University